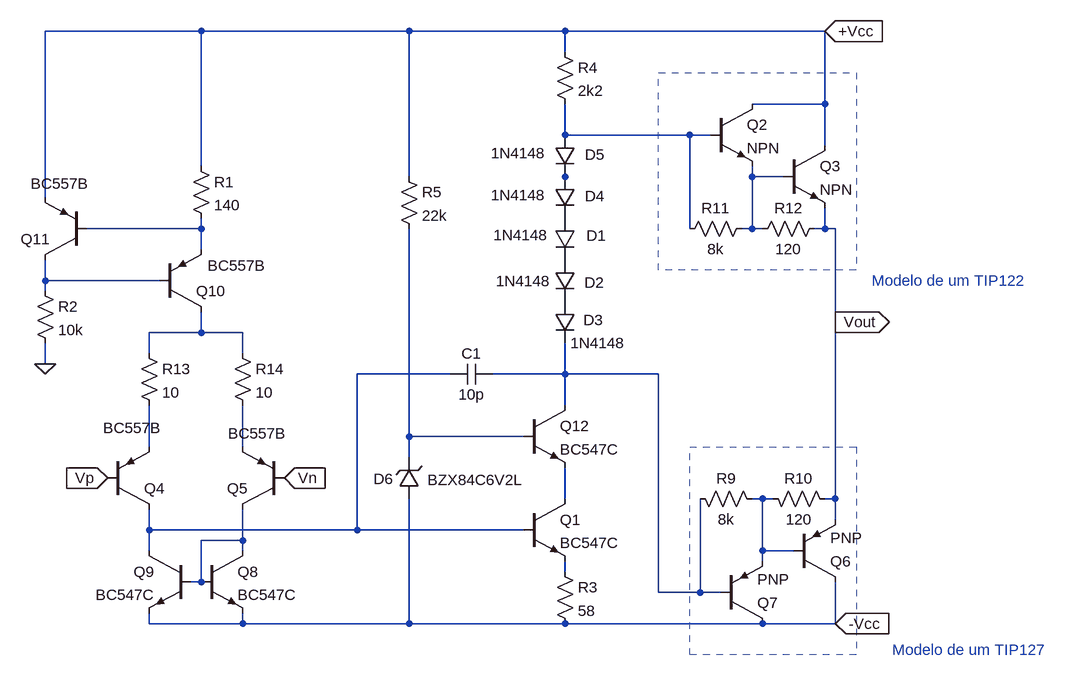
[diagram p0: schematic AudioAmpCascode.asc]
AudioAmpCascode.asc, the LTspice schematic file:
Version 4
SHEET 1 1444 680
WIRE -64 -528 -304 -528
WIRE 256 -528 -64 -528
WIRE 496 -528 256 -528
WIRE 896 -528 496 -528
WIRE 496 -496 496 -528
WIRE 896 -416 896 -528
WIRE 896 -416 784 -416
WIRE 496 -368 496 -416
WIRE 688 -368 496 -368
WIRE 720 -368 688 -368
WIRE 896 -352 896 -416
WIRE -64 -320 -64 -528
WIRE 256 -304 256 -528
WIRE 496 -304 496 -320
WIRE 784 -304 784 -320
WIRE 832 -304 784 -304
WIRE -304 -272 -304 -528
WIRE -64 -224 -64 -240
WIRE -64 -224 -240 -224
WIRE 688 -224 688 -368
WIRE 784 -224 784 -304
WIRE 784 -224 768 -224
WIRE 800 -224 784 -224
WIRE 896 -224 896 -256
WIRE 896 -224 880 -224
WIRE 912 -224 896 -224
WIRE -64 -192 -64 -224
WIRE -304 -144 -304 -176
WIRE -128 -144 -304 -144
WIRE -304 -128 -304 -144
WIRE 912 -80 912 -224
WIRE -64 -64 -64 -96
WIRE -64 -64 -144 -64
WIRE 0 -64 -64 -64
WIRE -144 -32 -144 -64
WIRE 0 -32 0 -64
WIRE -304 -16 -304 -48
WIRE 320 0 176 0
WIRE 496 0 496 -48
WIRE 496 0 384 0
WIRE 640 0 496 0
WIRE 496 48 496 0
WIRE 256 96 256 -224
WIRE 432 96 256 96
WIRE -144 112 -144 48
WIRE 0 112 0 48
WIRE 256 128 256 96
WIRE 496 192 496 144
WIRE 800 192 784 192
WIRE 816 192 800 192
WIRE 912 192 912 -80
WIRE 912 192 896 192
WIRE 912 224 912 192
WIRE -144 240 -144 208
WIRE 176 240 176 0
WIRE 176 240 -144 240
WIRE 432 240 176 240
WIRE 0 256 0 208
WIRE 0 256 -64 256
WIRE -144 272 -144 240
WIRE 0 272 0 256
WIRE 800 272 800 192
WIRE 848 272 800 272
WIRE 800 288 800 272
WIRE 496 304 496 288
WIRE -64 320 -64 256
WIRE -64 320 -80 320
WIRE 640 336 640 0
WIRE 704 336 704 192
WIRE 704 336 640 336
WIRE 736 336 704 336
WIRE -144 384 -144 368
WIRE 0 384 0 368
WIRE 0 384 -144 384
WIRE 256 384 256 192
WIRE 256 384 0 384
WIRE 496 384 256 384
WIRE 800 384 496 384
WIRE 912 384 912 320
WIRE 912 384 800 384
FLAG 896 -528 +Vcc
IOPIN 896 -528 In
FLAG 912 384 -Vcc
IOPIN 912 384 In
FLAG 912 -80 Vout
IOPIN 912 -80 Out
FLAG -208 160 Vp
IOPIN -208 160 In
FLAG 64 160 Vn
IOPIN 64 160 In
FLAG -304 -16 0
SYMBOL pnp -208 208 M180
WINDOW 3 -7 125 Left 2
SYMATTR Value BC557B
SYMATTR InstName Q4
SYMBOL pnp 64 208 R180
WINDOW 3 -3 117 Left 2
SYMATTR Value BC557B
SYMATTR InstName Q5
SYMBOL res 688 176 M90
WINDOW 0 0 56 VBottom 2
WINDOW 3 32 56 VTop 2
SYMATTR InstName R9
SYMATTR Value 8k
SYMBOL res 800 176 M90
WINDOW 0 0 56 VBottom 2
WINDOW 3 32 56 VTop 2
SYMATTR InstName R10
SYMATTR Value 120
SYMBOL npn 720 -416 R0
SYMATTR InstName Q2
SYMBOL npn 832 -352 R0
SYMATTR InstName Q3
SYMBOL res 672 -208 R270
WINDOW 0 32 56 VTop 2
WINDOW 3 0 56 VBottom 2
SYMATTR InstName R11
SYMATTR Value 8k
SYMBOL res 784 -208 R270
WINDOW 0 32 56 VTop 2
WINDOW 3 0 56 VBottom 2
SYMATTR InstName R12
SYMATTR Value 120
SYMBOL pnp 848 320 M180
SYMATTR InstName Q6
SYMBOL pnp 736 384 M180
SYMATTR InstName Q7
SYMBOL npn 432 192 R0
SYMATTR InstName Q1
SYMATTR Value BC547C
SYMBOL cap 384 -16 R90
WINDOW 0 0 32 VBottom 2
WINDOW 3 32 32 VTop 2
SYMATTR InstName C1
SYMATTR Value 10p
SYMBOL diode 480 -240 R0
WINDOW 0 49 27 Left 2
WINDOW 3 -94 26 Left 2
SYMATTR InstName D1
SYMATTR Value 1N4148
SYMBOL diode 480 -176 R0
WINDOW 0 46 35 Left 2
WINDOW 3 -90 33 Left 2
SYMATTR InstName D2
SYMATTR Value 1N4148
SYMBOL diode 480 -112 R0
WINDOW 0 44 29 Left 2
SYMATTR InstName D3
SYMATTR Value 1N4148
SYMBOL diode 480 -304 R0
WINDOW 0 47 30 Left 2
WINDOW 3 -98 28 Left 2
SYMATTR InstName D4
SYMATTR Value 1N4148
SYMBOL diode 480 -368 R0
WINDOW 0 47 30 Left 2
WINDOW 3 -98 28 Left 2
SYMATTR InstName D5
SYMATTR Value 1N4148
SYMBOL res -160 -48 R0
SYMATTR InstName R13
SYMATTR Value 10
SYMBOL res -16 -48 R0
SYMATTR InstName R14
SYMATTR Value 10
SYMBOL npn -64 272 R0
SYMATTR InstName Q8
SYMATTR Value BC547C
SYMBOL npn -80 272 M0
SYMATTR InstName Q9
SYMATTR Value BC547C
SYMBOL pnp -128 -96 M180
WINDOW 3 74 71 Left 2
SYMATTR Value BC557B
SYMATTR InstName Q10
SYMBOL pnp -240 -176 R180
WINDOW 3 -3 117 Left 2
SYMATTR Value BC557B
SYMATTR InstName Q11
SYMBOL res -80 -336 R0
SYMATTR InstName R1
SYMATTR Value 140
SYMBOL res -320 -144 R0
SYMATTR InstName R2
SYMATTR Value 10k
SYMBOL res 480 -512 R0
SYMATTR InstName R4
SYMATTR Value 2k2
SYMBOL res 480 288 R0
SYMATTR InstName R3
SYMATTR Value 58
SYMBOL npn 432 48 R0
SYMATTR InstName Q12
SYMATTR Value BC547C
SYMBOL zener 272 192 R180
WINDOW 0 40 31 Left 2
WINDOW 3 -159 29 Left 2
SYMATTR InstName D6
SYMATTR Value BZX84C6V2L
SYMBOL res 240 -320 R0
SYMATTR InstName R5
SYMATTR Value 22k
TEXT 968 -144 Left 2 ;Modelo de um TIP122
TEXT 1000 424 Left 2 ;Modelo de um TIP127
RECTANGLE Normal 944 432 688 112 2
RECTANGLE Normal 944 -160 640 -464 2

The netlist it stands for:
* AudioAmpCascode.asc
Q4 N007 Vp N010 0 BC557B
Q5 N014 Vn N011 0 BC557B
R9 N008 N013 8k
R10 N013 Vout 120
Q2 +Vcc N001 N003 0 NPN
Q3 +Vcc N003 Vout 0 NPN
R11 N001 N003 8k
R12 N003 Vout 120
Q6 -Vcc N013 Vout 0 PNP
Q7 -Vcc N008 N013 0 PNP
Q1 N012 N007 N015 0 BC547C
C1 N008 N007 10p
D1 P001 P002 1N4148
D2 P002 P003 1N4148
D3 P003 N008 1N4148
D4 N002 P001 1N4148
D5 N001 N002 1N4148
R13 N006 N010 10
R14 N006 N011 10
Q8 N014 N014 -Vcc 0 BC547C
Q9 N007 N014 -Vcc 0 BC547C
Q10 N006 N005 N004 0 BC557B
Q11 N005 N004 +Vcc 0 BC557B
R1 +Vcc N004 140
R2 N005 0 10k
R4 +Vcc N001 2k2
R3 N015 -Vcc 58
Q12 N008 N009 N012 0 BC547C
D6 -Vcc N009 BZX84C6V2L
R5 +Vcc N009 22k
.model D D
.lib standard.dio
.model NPN NPN
.model PNP PNP
.lib standard.bjt
* Modelo de um TIP122
* Modelo de um TIP127
.backanno
.end